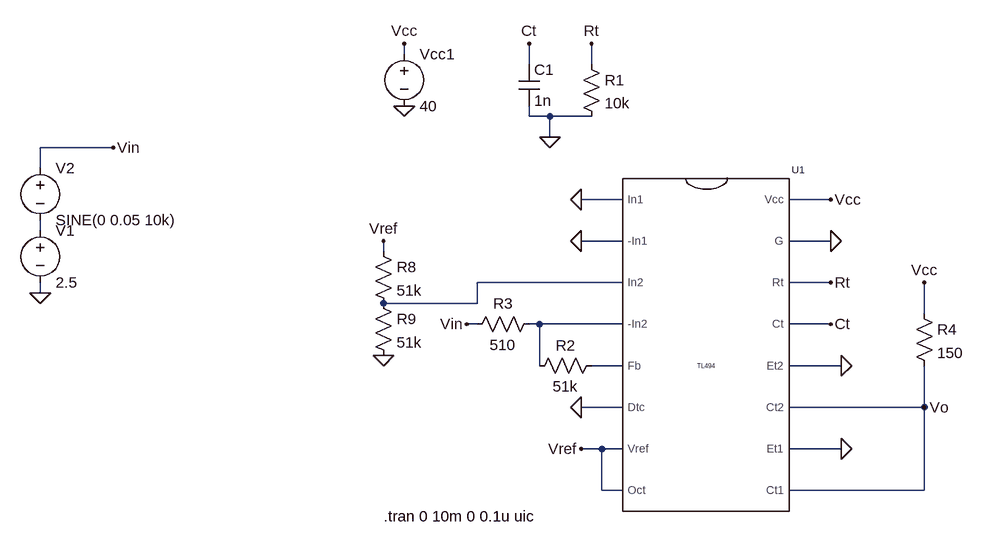
[diagram p0: schematic Banco prueba tl494.asc]
Banco prueba tl494.asc, the LTspice schematic file:
Version 4
SHEET 1 1104 680
WIRE -224 -160 -224 -176
WIRE -32 -144 -32 -176
WIRE 64 -144 64 -176
WIRE -32 -64 -32 -80
WIRE 0 -64 -32 -64
WIRE 64 -64 0 -64
WIRE 0 -32 0 -64
WIRE -672 -16 -784 -16
WIRE -784 16 -784 -16
WIRE 112 64 48 64
WIRE 432 64 368 64
WIRE -784 112 -784 96
WIRE 112 128 48 128
WIRE 432 128 368 128
WIRE -256 144 -256 128
WIRE 112 192 -112 192
WIRE 432 192 368 192
WIRE -784 208 -784 192
WIRE -112 224 -112 192
WIRE -112 224 -256 224
WIRE 576 240 576 192
WIRE -112 256 -128 256
WIRE -16 256 -32 256
WIRE 112 256 -16 256
WIRE 432 256 368 256
WIRE -16 320 -16 256
WIRE 112 320 64 320
WIRE 448 320 368 320
WIRE 112 384 48 384
WIRE 576 384 576 320
WIRE 576 384 368 384
WIRE 80 448 48 448
WIRE 112 448 80 448
WIRE 448 448 368 448
WIRE 80 512 80 448
WIRE 112 512 80 512
WIRE 576 512 576 384
WIRE 576 512 368 512
FLAG -224 -80 0
FLAG 432 64 Vcc
FLAG 432 128 0
FLAG 0 -32 0
FLAG 432 192 Rt
FLAG 64 -176 Rt
FLAG -32 -176 Ct
FLAG 432 256 Ct
FLAG -224 -176 Vcc
FLAG 48 64 0
FLAG 48 128 0
FLAG 48 384 0
FLAG 448 320 0
FLAG 448 448 0
FLAG 48 448 Vref
FLAG -256 304 0
FLAG -256 128 Vref
FLAG -128 256 Vin
FLAG -784 208 0
FLAG -672 -16 Vin
FLAG 576 192 Vcc
FLAG 576 384 Vo
SYMBOL tl494 240 320 R0
SYMATTR InstName U1
SYMBOL voltage -224 -176 R0
WINDOW 123 0 0 Left 0
WINDOW 39 0 0 Left 0
SYMATTR InstName Vcc1
SYMATTR Value 40
SYMBOL cap -48 -144 R0
SYMATTR InstName C1
SYMATTR Value 1n
SYMBOL res 48 -160 R0
SYMATTR InstName R1
SYMATTR Value 10k
SYMBOL res 80 304 R90
WINDOW 0 0 56 VBottom 2
WINDOW 3 32 56 VTop 2
SYMATTR InstName R2
SYMATTR Value 51k
SYMBOL res -16 240 R90
WINDOW 0 0 56 VBottom 2
WINDOW 3 32 56 VTop 2
SYMATTR InstName R3
SYMATTR Value 510
SYMBOL res -272 128 R0
SYMATTR InstName R8
SYMATTR Value 51k
SYMBOL res -272 208 R0
SYMATTR InstName R9
SYMATTR Value 51k
SYMBOL voltage -784 96 R0
WINDOW 123 0 0 Left 0
WINDOW 39 0 0 Left 0
SYMATTR InstName V1
SYMATTR Value 2.5
SYMBOL voltage -784 0 R0
WINDOW 123 0 0 Left 0
WINDOW 39 0 0 Left 0
SYMATTR InstName V2
SYMATTR Value SINE(0 0.05 10k)
SYMBOL res 560 224 R0
SYMATTR InstName R4
SYMATTR Value 150
TEXT -256 552 Left 2 !.tran 0 10m 0 0.1u uic

The netlist it stands for:
* Banco prueba tl494.asc
XU1 0 0 N002 N003 N004 0 Vref Vref Vo 0 Vo 0 Ct Rt 0 Vcc TL494 TL494  ; pins In1 -In1 In2 -In2 Fb Dtc Vref Oct Ct1 Et1 Ct2 Et2 Ct Rt G Vcc
Vcc1 Vcc 0 40
C1 Ct 0 1n
R1 Rt 0 10k
R2 N004 N003 51k
R3 N003 Vin 510
R8 Vref N002 51k
R9 N002 0 51k
V1 N001 0 2.5
V2 Vin N001 SINE(0 0.05 10k)
R4 Vcc Vo 150
.tran 0 10m 0 0.1u uic
.lib tl494.sub
.backanno
.end